# Altium schematic sheet DAC_filter_stage.SchDoc
size A3; SheetNumber: 4; SheetTotal: 8
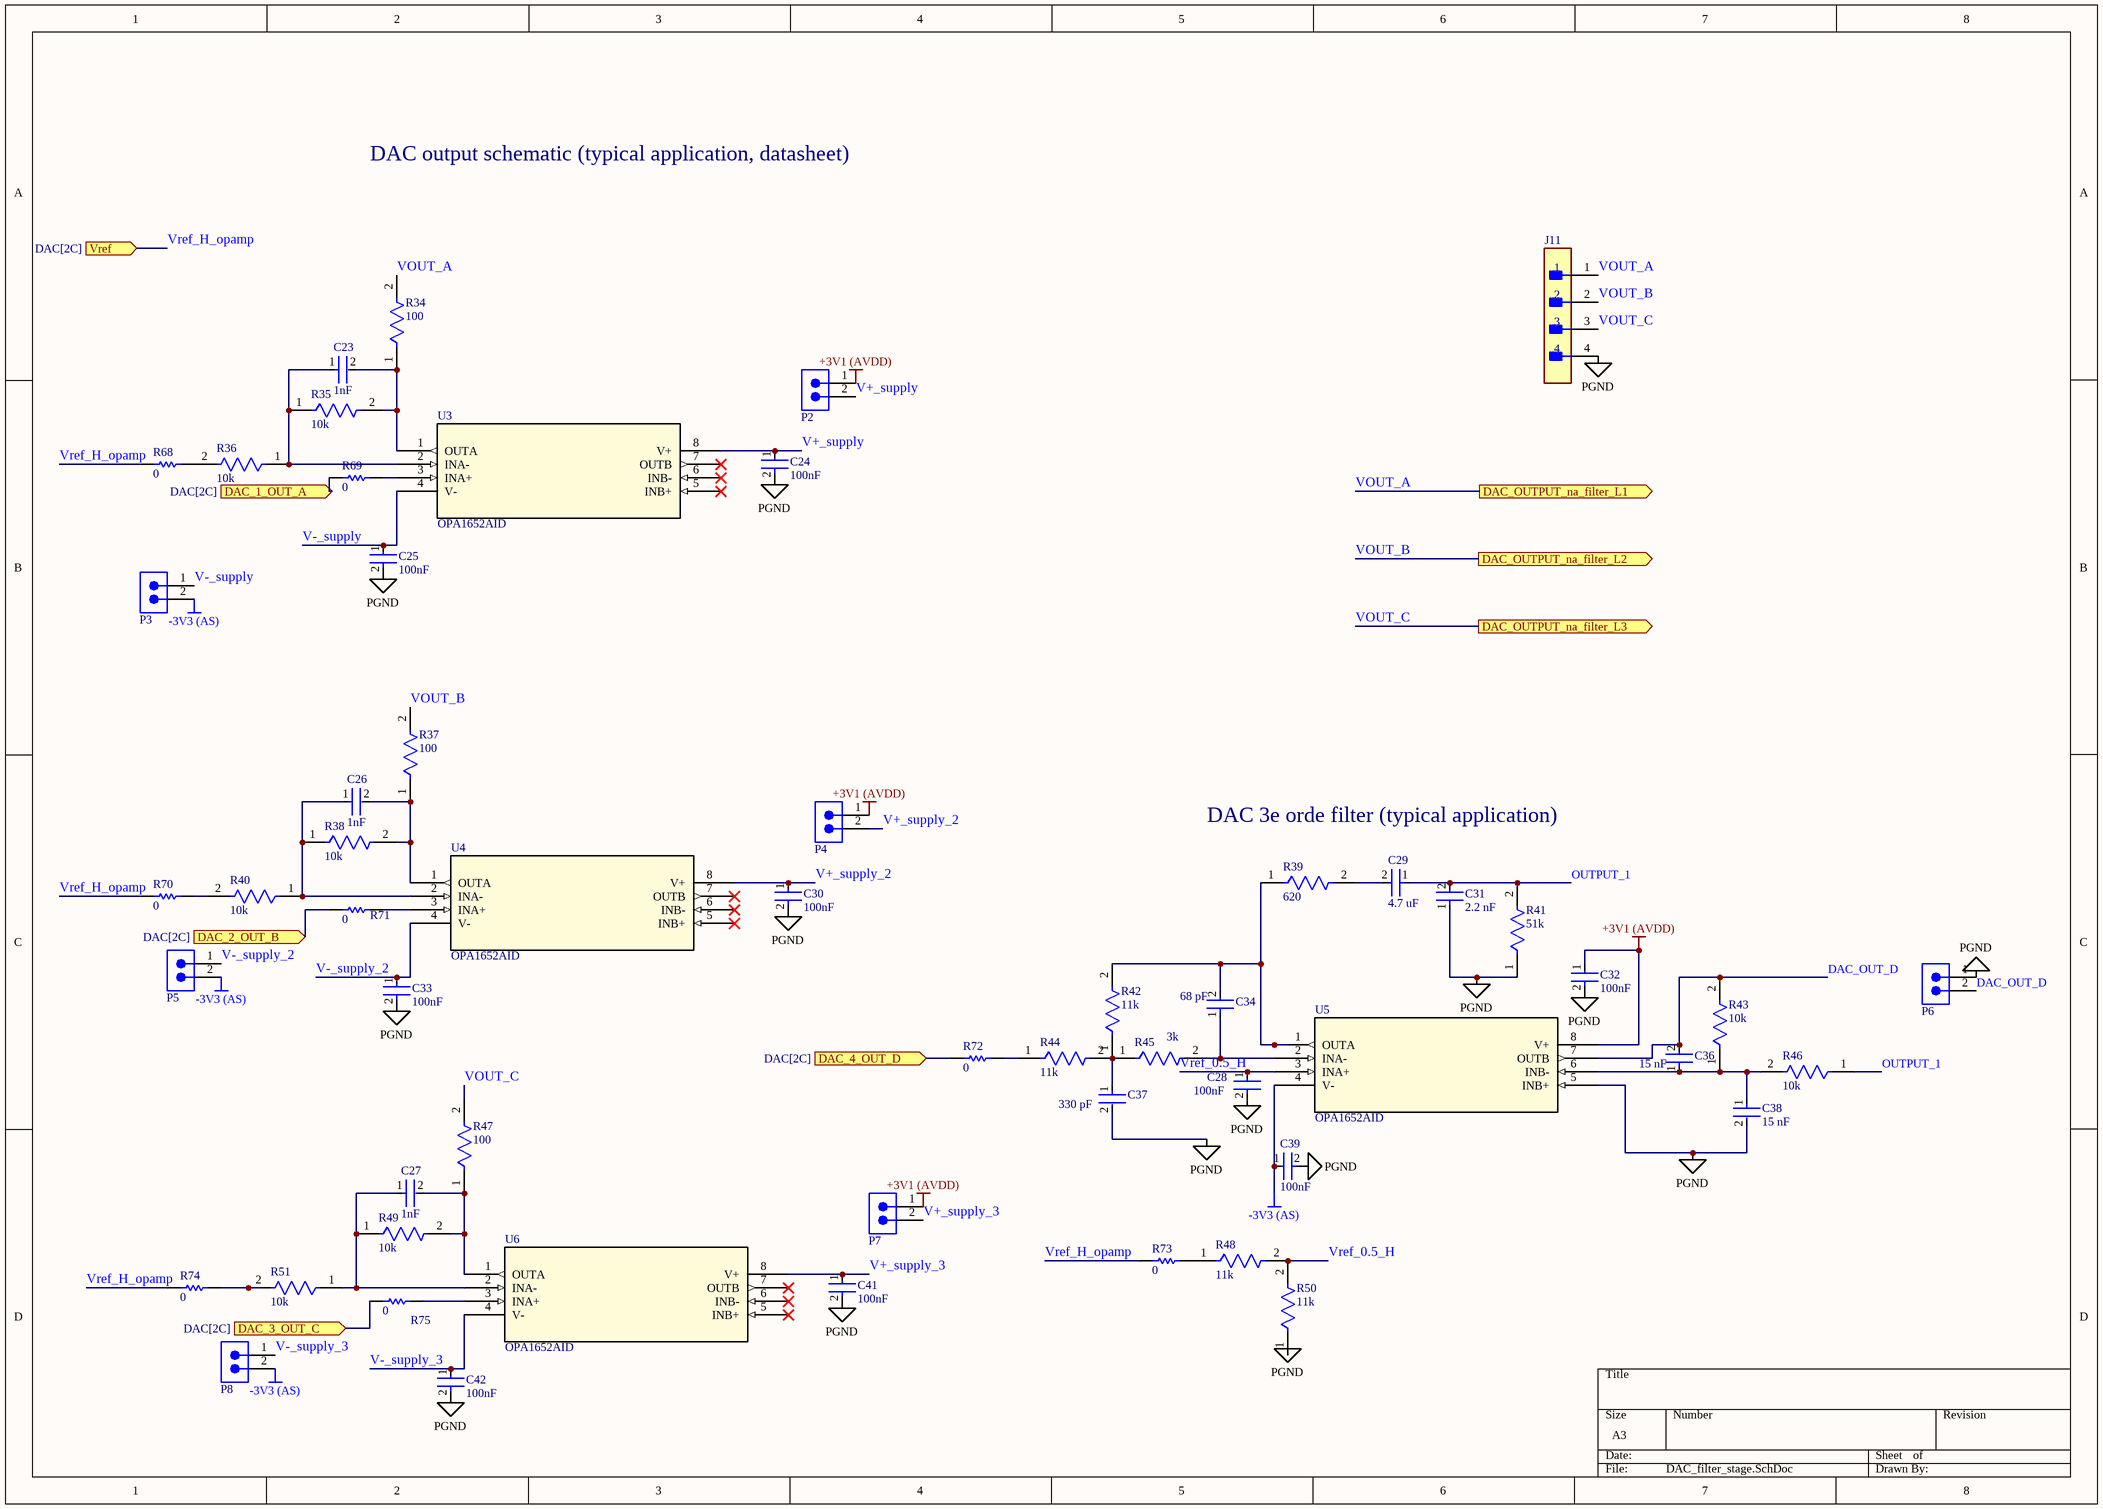
[diagram p0: DAC_filter_stage.SchDoc]

## Parts
C23  1nF  [FP-CC0603-DA-MFG]
C24  100nF  [FP-GRM15-MFG]
C25  100nF  [FP-GRM15-MFG]
C26  1nF  [FP-CC0603-DA-MFG]
C27  1nF  [FP-CC0603-DA-MFG]
C28  100nF  [FP-GRM15-MFG]
C29  4.7 uF  [FP-C0603C-CF-MFG]
C30  100nF  [FP-GRM15-MFG]
C31  2.2 nF  [FP-AC0603-MFG]
C32  100nF  [FP-GRM15-MFG]
C33  100nF  [FP-GRM15-MFG]
C34  68 pF  [FP-AC0603-MFG]
C36  15 nF  [FP-C0603C-CF-MFG]
C37  330 pF  [FP-AC0603-MFG]
C38  15 nF  [FP-C0603C-CF-MFG]
C39  100nF  [FP-GRM15-MFG]
C41  100nF  [FP-GRM15-MFG]
C42  100nF  [FP-GRM15-MFG]
J11  TSW-104-22-G-S  [FP-TSW-104-22-G-S-MFG]  (value not drawn)
P2  TSW-102-26-T-S  [SMTC-TSW-102-26-XX-S]  (value not drawn)
P3  TSW-102-26-T-S  [SMTC-TSW-102-26-XX-S]  (value not drawn)
P4  TSW-102-26-T-S  [SMTC-TSW-102-26-XX-S]  (value not drawn)
P5  TSW-102-26-T-S  [SMTC-TSW-102-26-XX-S]  (value not drawn)
P6  TSW-102-26-T-S  [SMTC-TSW-102-26-XX-S]  (value not drawn)
P7  TSW-102-26-T-S  [SMTC-TSW-102-26-XX-S]  (value not drawn)
P8  TSW-102-26-T-S  [SMTC-TSW-102-26-XX-S]  (value not drawn)
R34  100  [FP-RC1608-IPC_B]
R35  10k  [FP-RC1608-IPC_B]
R36  10k  [FP-RC1608-IPC_B]
R37  100  [FP-RC1608-IPC_B]
R38  10k  [FP-RC1608-IPC_B]
R39  620  [FP-RC1608-IPC_B]
R40  10k  [FP-RC1608-IPC_B]
R41  51k  [FP-RC1608-IPC_B]
R42  11k  [FP-RC1608-IPC_B]
R43  10k  [FP-RC1608-IPC_B]
R44  11k  [FP-RC1608-IPC_B]
R45  3k  [FP-RC1608-IPC_B]
R46  10k  [FP-RC1608-IPC_B]
R47  100  [FP-RC1608-IPC_B]
R48  11k  [FP-RC1608-IPC_B]
R49  10k  [FP-RC1608-IPC_B]
R50  11k  [FP-RC1608-IPC_B]
R51  10k  [FP-RC1608-IPC_B]
R68  0  [RESC2013X70X40NL20T20]
R69  0  [RESC2013X70X40NL20T20]
R70  0  [RESC2013X70X40NL20T20]
R71  0  [RESC2013X70X40NL20T20]
R72  0  [RESC2013X70X40NL20T20]
R73  0  [RESC2013X70X40NL20T20]
R74  0  [RESC2013X70X40NL20T20]
R75  0  [RESC2013X70X40NL20T20]
U3  OPA1652AID  [D8]
U4  OPA1652AID  [D8]
U5  OPA1652AID  [D8]
U6  OPA1652AID  [D8]

## Ports
DAC_1_OUT_A (in, see DAC[2C]), DAC_2_OUT_B (in, see DAC[2C]), DAC_3_OUT_C (in, see DAC[2C]), DAC_4_OUT_D (in, see DAC[2C]), DAC_OUTPUT_na_filter_L1 (out, see DAC[4C]), DAC_OUTPUT_na_filter_L2 (out, see DAC[4C]), DAC_OUTPUT_na_filter_L3 (out, see DAC[4C]), Vref (in, see DAC[2C])

## Nets
+3V1 (AVDD): C32.1 P2.1 P4.1 P7.1 U5.8(V+)
-3V3 (AS): C39.1 P3.2 P5.2 P8.2 U5.4(V-)
PGND: C24.2 C25.2 C28.2 C30.2 C31.1 C32.2 C33.2 C37.2 C38.2 C39.2 C41.2 C42.2 J11.4 P6.1 R41.1 U5.5(INB+)
DAC_1_OUT_A: R69.1 ; port DAC_1_OUT_A
DAC_2_OUT_B: R71.1 ; port DAC_2_OUT_B
DAC_3_OUT_C: R75.1 ; port DAC_3_OUT_C
DAC_4_OUT_D: R72.1 ; port DAC_4_OUT_D
DAC_OUT_D: C36.2 P6.2 R43.2 U5.7(OUTB)
OUTPUT_1: C29.1 C31.2 R41.2 R46.1
V+_supply: C24.1 P2.2 U3.8(V+)
V+_supply_2: C30.1 P4.2 U4.8(V+)
V+_supply_3: C41.1 P7.2 U6.8(V+)
V-_supply: C25.1 P3.1 U3.4(V-)
V-_supply_2: C33.1 P5.1 U4.4(V-)
V-_supply_3: C42.1 P8.1 U6.4(V-)
VOUT_A: J11.1 R34.2 ; port DAC_OUTPUT_na_filter_L1
VOUT_B: J11.2 R37.2 ; port DAC_OUTPUT_na_filter_L2
VOUT_C: J11.3 R47.2 ; port DAC_OUTPUT_na_filter_L3
Vref_0.5_H: C28.1 R48.2 R50.2 U5.3(INA+)
Vref_H_opamp: R68.1 R70.1 R73.1 R74.1 ; port Vref
NetC23_1: C23.1 R35.1 R36.1 U3.2(INA-)
NetC23_2: C23.2 R34.1 R35.2 U3.1(OUTA)
NetC26_1: C26.1 R38.1 R40.1 U4.2(INA-)
NetC26_2: C26.2 R37.1 R38.2 U4.1(OUTA)
NetC27_1: C27.1 R49.1 R51.1 U6.2(INA-)
NetC27_2: C27.2 R47.1 R49.2 U6.1(OUTA)
NetC29_2: C29.2 R39.2
NetC34_1: C34.1 R45.2 U5.2(INA-)
NetC34_2: C34.2 R39.1 R42.2 U5.1(OUTA)
NetC36_1: C36.1 C38.1 R43.1 R46.2 U5.6(INB-)
NetC37_1: C37.1 R42.1 R44.2 R45.1
NetR36_2: R36.2 R68.2
NetR40_2: R40.2 R70.2
NetR44_1: R44.1 R72.2
NetR48_1: R48.1 R73.2
NetR51_2: R51.2 R74.2
NetR69_2: R69.2 U3.3(INA+)
NetR71_2: R71.2 U4.3(INA+)
NetR75_2: R75.2 U6.3(INA+)

Not connected (* = marked no-connect by the designer): R50 1; U3 5(INB+)* 6(INB-)* 7(OUTB)*; U4 5(INB+)* 6(INB-)* 7(OUTB)*; U6 5(INB+)* 6(INB-)* 7(OUTB)*

## Notes on the sheet
- DAC output schematic (typical application, datasheet)
- DAC 3e orde filter (typical application)
- Labels drawn without touching a wire or pin: PGND

## Library data of the parts
C23 C26 C27 = CMP-2000-05002-2: General Purpose Ceramic Capacitor, 0603, 1nF, 10%, X7R, 15%, 50V; Manufacturer Part Number: CC0603KRX7R7BB104; Manufacturer: YAGEO; Voltage Rating: 16 V; Tolerance: 0.1; Value: 100 nF; Package: CC0603-DA; ComponentLink2Description: Datasheet; Octopart: https://octopart.com/cc0603krx7r7bb104-yageo-192941; Temperature Range High: +125°C; Digikey Description: CAP CER 0.1UF 16V X7R 0603; Voltage: 16 V; Device Class L2: Capacitors; Height: 0.9mm; Temperature: -55°C to +125°C; Temperature Coefficient: 15%; Device Class L1: Passive Components; Device Class L3: Ceramic Capacitors; ComponentLink2URL: http://www.yageo.com/documents/recent/UPY-GPHC_X7R_6.3V-to-50V_18.pdf; Footprint Url: http://www.yageo.com/exep/pages/download/literatures/UPY-C_GEN_24.pdf; RoHS: TRUE; Temperature Range Low: -55°C; Temperature Characteristic: X7R; Lead Free: Yes; Capacitance: 100 nF; Category: Cap; Mouser Description: Multilayer Ceramic Capacitor, CC Series, 0.1 - F, - 10%, X7R, 16 V, 0603 [1608 Metric]; Material: Ceramic; Automotive: No
C24 C25 C28 C30 C32 C33 C39 C41 C42 = CMP-2100-03641-2: CAP CER 0.1UF 16V X7R 0402; Manufacturer Part Number: GRM155R71C104KA88D; Manufacturer: Murata; Eurocircuits generic parts: GPC0402104; Standoff Height: 0mm; Tolerance: 10%; Voltage Rating: 16Vdc; Material: Ceramic; Capacitance: 0.10μF; Value: 0.10μF; RoHS: TRUE; Temperature Characteristic: X7R; Octopart: https://octopart.com/grm155r71c104ka88d-murata-196880; Digikey Description: CAP CER 0.1UF 16V X7R 0402; Device Class L3: Ceramic Capacitors; Height: 0.55mm; ComponentLink2Description: Datasheet; Temperature Range Low: -55°C; Ipc Land Pattern Name: CAPC10050X219; ComponentLink2URL: https://search.murata.co.jp/Ceramy/image/img/A01X/G101/ENG/GRM155R71H471KA01-01A.pdf; Device Class L1: Passive Components; Lead Free: yes; Category: Cap; Package: GRM15; Temperature: -55°C to +125°C; Device Class L2: Capacitors; Temperature Range High: +125°C; Mouser Description: 0402 0.1 uF 16V ±10 % Tolerance X7R SMT Multilayer Ceramic Capacitor
C29 = CMP-2006-03056-2: CAP CER 4.7 UF 50V 5% X7R 0603; Manufacturer Part Number: C0603C104J5RACTU; Manufacturer: KEMET; Generic part Eurocircuits:: GPC0603475-10; Automotive Grade: Grade 1; Tolerance: 0.05; Capacitance: 4.7 μF; Value: 4.7 μF; Material: Ceramic; Temperature Coefficient: 30ppm/°C; ComponentLink2Description: Datasheet; Voltage Rating: 50 V; Digikey Description: CAP CER 0.1UF 50V 5% X7R 0603; Temperature Range High: +125°C; Device Class L2: Capacitors; Octopart: https://octopart.com/c0603c104j5ractu-kemet-10440638; RoHS: TRUE; Mouser Description: Multilayer Ceramic Capacitors MLCC - SMD/SMT 50volts 0.1uF X7R 5%; Temperature Range Low: -55°C; Automotive: Yes; Lead Free: Yes; ComponentLink2URL: https://api.kemet.com/component-edge/download/datasheet/C0603C100J5GACAUTO.pdf; Device Class L3: Ceramic Capacitors; Package: C0603C-CF; Category: Cap; Temperature: -55°C to +125°C; Height: 0.87mm; Temperature Characteristic: X7R; Device Class L1: Passive Components
C31 = CMP-03422-001062-1: AC0603 2.2 pF NP0 5.00% 50 V; Manufacturer Part Number: AC0603JRNPO9BN271; Manufacturer: Yageo; Generic part Eurocircuits:: GPC0603222; Material: Ceramic; Tolerance: 0.05; Voltage Rating: 50 V; Temperature Coefficient: 15%; Automotive Grade: Grade 1; ComponentLink2URL: http://www.yageo.com/documents/recent/UPY-AC_NP0X7R_16V-to-630V_12.pdf; Value: 2.2 nF; Capacitance: 2.2 nF; Lead Free: Yes; Automotive: Yes; Package: AC0603; RoHS: TRUE; Device Class L2: Capacitors; Footprint Url: http://www.yageo.com/exep/pages/download/literatures/UPY-C_GEN_24.pdf; Height: 0.9mm; Category: Cap; Device Class L1: Passive Components; Temperature: -55°C to +125°C; Ipc Land Pattern Name: CAPC16080X80; Octopart: https://octopart.com/ac0603jrnpo9bn271-yageo-87214073; ComponentLink2Description: Datasheet; Device Class L3: Ceramic Capacitors; Temperature Characteristic: NP0; Temperature Range High: +125°C; Temperature Range Low: -55°C
C34 = CMP-03422-001062-1: AC0603 68 pF NP0 5.00% 50 V; Manufacturer Part Number: AC0603JRNPO9BN271; Manufacturer: Yageo; Generic part Eurocircuits:: GPC0603680; Material: Ceramic; Tolerance: 0.05; Voltage Rating: 50 V; Temperature Coefficient: 15%; Automotive Grade: Grade 1; ComponentLink2URL: http://www.yageo.com/documents/recent/UPY-AC_NP0X7R_16V-to-630V_12.pdf; Value: 68 pF; Capacitance: 68 pF; Lead Free: Yes; Automotive: Yes; Package: AC0603; RoHS: TRUE; Device Class L2: Capacitors; Footprint Url: http://www.yageo.com/exep/pages/download/literatures/UPY-C_GEN_24.pdf; Height: 0.9mm; Category: Cap; Device Class L1: Passive Components; Temperature: -55°C to +125°C; Ipc Land Pattern Name: CAPC16080X80; Octopart: https://octopart.com/ac0603jrnpo9bn271-yageo-87214073; ComponentLink2Description: Datasheet; Device Class L3: Ceramic Capacitors; Temperature Characteristic: NP0; Temperature Range High: +125°C; Temperature Range Low: -55°C
C36 C38 = CMP-2006-03056-2: CAP CER 15 nF 50V 5% X7R 0603                                           Eurocircuits generic components:                                 GPC0603153; Manufacturer Part Number: C0603C104J5RACTU; Manufacturer: KEMET; Automotive Grade: Grade 1; Tolerance: 0.05; Material: Ceramic; Temperature Coefficient: 30ppm/°C; ComponentLink2Description: Datasheet; Voltage Rating: 50 V; Digikey Description: CAP CER 0.1UF 50V 5% X7R 0603; Temperature Range High: +125°C; Device Class L2: Capacitors; Capacitance: 15 nF; Value: 15 nF; Octopart: https://octopart.com/c0603c104j5ractu-kemet-10440638; RoHS: TRUE; Mouser Description: Multilayer Ceramic Capacitors MLCC - SMD/SMT 50volts 0.1uF X7R 5%; Temperature Range Low: -55°C; Automotive: Yes; Lead Free: Yes; ComponentLink2URL: https://api.kemet.com/component-edge/download/datasheet/C0603C100J5GACAUTO.pdf; Device Class L3: Ceramic Capacitors; Package: C0603C-CF; Category: Cap; Temperature: -55°C to +125°C; Height: 0.87mm; Temperature Characteristic: X7R; Device Class L1: Passive Components; Generic part Eurocircuits:: GPC0603153
C37 = CMP-03422-001062-1: AC0603 330 pF NP0 5.00% 50 V; Manufacturer Part Number: AC0603JRNPO9BN271; Manufacturer: Yageo; Generic part Eurocircuits:: GPC0603331; Material: Ceramic; Tolerance: 0.05; Voltage Rating: 50 V; Temperature Coefficient: 15%; Automotive Grade: Grade 1; ComponentLink2URL: http://www.yageo.com/documents/recent/UPY-AC_NP0X7R_16V-to-630V_12.pdf; Value: 330 pF; Capacitance: 330 pF; Lead Free: Yes; Automotive: Yes; Package: AC0603; RoHS: TRUE; Device Class L2: Capacitors; Footprint Url: http://www.yageo.com/exep/pages/download/literatures/UPY-C_GEN_24.pdf; Height: 0.9mm; Category: Cap; Device Class L1: Passive Components; Temperature: -55°C to +125°C; Ipc Land Pattern Name: CAPC16080X80; Octopart: https://octopart.com/ac0603jrnpo9bn271-yageo-87214073; ComponentLink2Description: Datasheet; Device Class L3: Ceramic Capacitors; Temperature Characteristic: NP0; Temperature Range High: +125°C; Temperature Range Low: -55°C
J11 = CMP-02766-001236-1: GENERIC PART NUMBER: GPHA-1X04 / CONN HEADER VERT 4POS 2.54MM; Number of Contacts: 4; Gender: Male; Termination: Solder; Pitch: 2.54mm; Mount: Through Hole; Number of Rows: 1; Packaging: Bulk; Contact Material: Bronze; Contact Plating: Gold; REACH SVHC: No SVHC; Radiation Hardening: No; GENERIC PART NUMBER: GPHA-1X04
P2-P8 = CMP-1024-00328-1: 0.025" SQ Post Header, Through-hole, Vertical, -55 to 105 degC, 2.54 mm Pitch, 2-Pin, Male, RoHS; Manufacturer: Samtec; Pitch: 2.54 mm; PackageReference: TSW-102-26-XX-S; ComponentLink1URL: http://www.samtec.com; ComponentLink3Description: Package Specification; ComponentLink3URL: http://www.samtec.com/documents/webfiles/cpdf/TSW-XXX-XX-XXX-X-XX-XXX-MKT.pdf; DatasheetVersion: F-214; ComponentLink2URL: http://www.samtec.com/documents/webfiles/pdf/TSW_TH.PDF; Mounting Technology: Through-hole; ComponentLink2Description: Datasheet; PartNumber: TSW-102-26-T-S; ComponentLink1Description: Manufacturer URL; PackageDescription: .025[0.64] SQ. Post Terminal Strip Assembly; Orientation: Vertical; PackageVersion: DM, 8/1988; Temperature Range: -55 to 105 degC; RoHS: True
R34 R37 R47 = CMP-13261-004935-1: Res Thick Film 0603 100Ω 1% 0.1W ±100ppm/°C Molded SMD T/R; Generic part Eurocircuits:: GPR060311K; Resistance: 11k; Voltage Rating (DC): 50V; Power Rating: 100mW; Contact Plating: Tin; Depth: 0.8mm; Width: 800um; Tolerance: 1%; Lead Free: Lead Free; Composition: Thick Film; Military Standard: Not; Temperature Coefficient: 100ppm/°C; Radiation Hardening: No; Length: 1.6mm; Case/Package: 0603; Max Operating Temperature: 155°C; Packaging: Tape and Reel; Min Operating Temperature: -55°C
R35 R36 R38 R40 R49 R51 = CMP-13261-004935-1: Res Thick Film 0603 11kΩ 1% 0.1W ±100ppm/°C Molded SMD T/R; Generic part Eurocircuits:: GPR060311K; Resistance: 11k; Voltage Rating (DC): 50V; Power Rating: 100mW; Contact Plating: Tin; Depth: 0.8mm; Width: 800um; Tolerance: 1%; Lead Free: Lead Free; Composition: Thick Film; Military Standard: Not; Temperature Coefficient: 100ppm/°C; Radiation Hardening: No; Length: 1.6mm; Case/Package: 0603; Max Operating Temperature: 155°C; Packaging: Tape and Reel; Min Operating Temperature: -55°C
R39 = CMP-13261-004935-1: Res Thick Film 0603 620Ω 1% 0.1W ±100ppm/°C Molded SMD T/R; Generic part Eurocircuits:: GPR0603620R; Voltage Rating (DC): 50V; Power Rating: 100mW; Resistance: 620; Contact Plating: Tin; Depth: 0.8mm; Width: 800um; Tolerance: 1%; Lead Free: Lead Free; Composition: Thick Film; Military Standard: Not; Temperature Coefficient: 100ppm/°C; Radiation Hardening: No; Length: 1.6mm; Case/Package: 0603; Max Operating Temperature: 155°C; Packaging: Tape and Reel; Min Operating Temperature: -55°C
R41 = CMP-13261-004935-1: Res Thick Film 0603 51kΩ 1% 0.1W ±100ppm/°C Molded SMD T/R; Generic part Eurocircuits:: GPR060351K; Voltage Rating (DC): 50V; Power Rating: 100mW; Resistance: 51k; Contact Plating: Tin; Depth: 0.8mm; Width: 800um; Tolerance: 1%; Lead Free: Lead Free; Composition: Thick Film; Military Standard: Not; Temperature Coefficient: 100ppm/°C; Radiation Hardening: No; Length: 1.6mm; Case/Package: 0603; Max Operating Temperature: 155°C; Packaging: Tape and Reel; Min Operating Temperature: -55°C
R42 R44 R48 R50 = CMP-13261-004935-1: Res Thick Film 0603 11kΩ 1% 0.1W ±100ppm/°C Molded SMD T/R; Generic part Eurocircuits:: GPR060311K; Voltage Rating (DC): 50V; Power Rating: 100mW; Resistance: 11k; Contact Plating: Tin; Depth: 0.8mm; Width: 800um; Tolerance: 1%; Lead Free: Lead Free; Composition: Thick Film; Military Standard: Not; Temperature Coefficient: 100ppm/°C; Radiation Hardening: No; Length: 1.6mm; Case/Package: 0603; Max Operating Temperature: 155°C; Packaging: Tape and Reel; Min Operating Temperature: -55°C
R43 R46 = CMP-13261-004935-1: Res Thick Film 0603 10kΩ 1% 0.1W ±100ppm/°C Molded SMD T/R / Generic part Eurocircuits: / GPR060310K; Voltage Rating (DC): 50V; Power Rating: 100mW; Resistance: 10k; Contact Plating: Tin; Depth: 0.8mm; Width: 800um; Tolerance: 1%; Lead Free: Lead Free; Composition: Thick Film; Military Standard: Not; Temperature Coefficient: 100ppm/°C; Radiation Hardening: No; Length: 1.6mm; Case/Package: 0603; Max Operating Temperature: 155°C; Packaging: Tape and Reel; Min Operating Temperature: -55°C; Generic part Eurocircuits:: GPR060310K
R45 = CMP-13261-004935-1: Res Thick Film 0603 3kΩ 1% 0.1W ±100ppm/°C Molded SMD T/R; Generic part Eurocircuits:: GPR06033K; Voltage Rating (DC): 50V; Power Rating: 100mW; Resistance: 3k; Contact Plating: Tin; Depth: 0.8mm; Width: 800um; Tolerance: 1%; Lead Free: Lead Free; Composition: Thick Film; Military Standard: Not; Temperature Coefficient: 100ppm/°C; Radiation Hardening: No; Length: 1.6mm; Case/Package: 0603; Max Operating Temperature: 155°C; Packaging: Tape and Reel; Min Operating Temperature: -55°C
R68-R75 = CMP-1665-00002-5: Chip Resistor, 0 Ohm, +/- 1%, 0.125 W, -55 to 155 degC, 0805 (2012 Metric), RoHS, Tape and Reel; PartNumber: ERJ-6GEY0R00V; Tolerance: 5%; Resistance: 0 Ohm; REACH SVHC: No SVHC; Min Operating Temperature: -55 degC; Case/Package: 0805; Packaging: Tape and Reel; Package Quantity: 5000; ComponentLink1Description: Manufacturer URL; PackageDescription: 2-Pin Surface Mount Device, Body 2 x 1.25 mm; Mounting Technology: Surface Mount; Max Operating Temperature: 155 degC; Width: 1.25 mm; RoHSCompliant: True; Height: 0.6 mm; ComponentLink1URL: http://www.panasonic.com/; ComponentLink2URL: http://industrial.panasonic.com/cdbs/www-data/pdf/RDA0000/AOA0000C84.pdf; Case Code (Imperial): 0805; DatasheetVersion: 03/2015; Length: 2 mm; Case Code (Metric): 2012; ComponentLink2Description: Datasheet; Radiation Hardening: No
U3-U6 = OPA1652AID: No Description Available; Mfr_Name: Texas Instruments; RefDes: RefDes; Type: Type